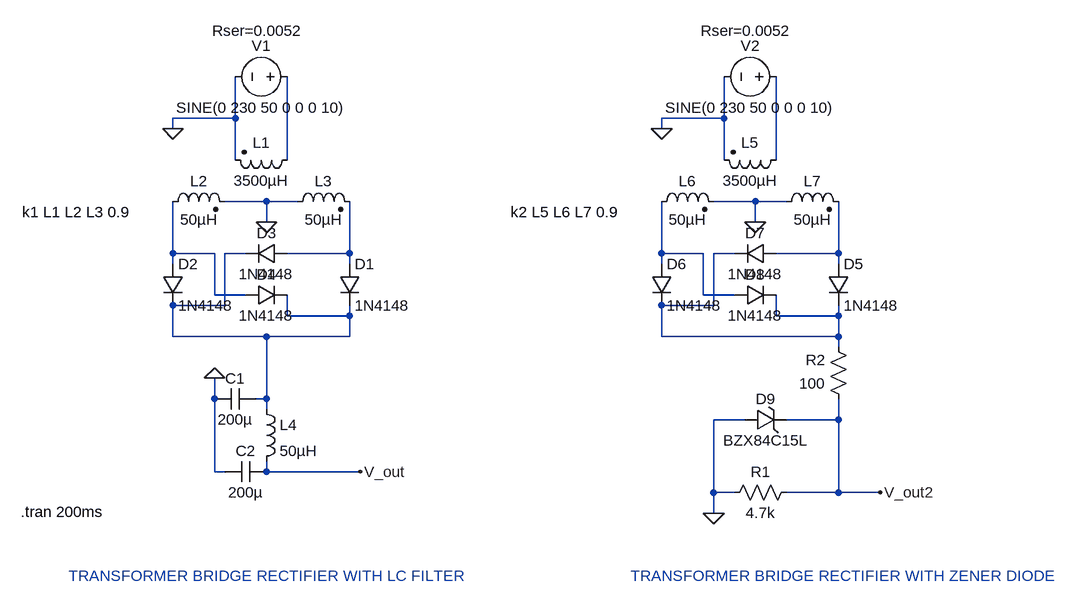
[diagram p0: schematic bride_rectifier_zenerdiode_LCfilter_2019A3PS0443H.asc]
bride_rectifier_zenerdiode_LCfilter_2019A3PS0443H.asc, the LTspice schematic file:
Version 4
SHEET 1 1148 704
WIRE -112 -16 -112 -80
WIRE -112 -16 -208 -16
WIRE 640 -16 640 -80
WIRE 640 -16 544 -16
WIRE -208 0 -208 -16
WIRE 544 0 544 -16
WIRE -112 48 -112 -16
WIRE -32 48 -32 -80
WIRE 640 48 640 -16
WIRE 720 48 720 -80
WIRE -64 112 -128 112
WIRE -16 112 -64 112
WIRE 688 112 624 112
WIRE 736 112 688 112
WIRE -64 144 -64 112
WIRE 688 144 688 112
WIRE -208 192 -208 112
WIRE -144 192 -208 192
WIRE -96 192 -128 192
WIRE 64 192 64 112
WIRE 64 192 -32 192
WIRE 544 192 544 112
WIRE 608 192 544 192
WIRE 656 192 624 192
WIRE 816 192 816 112
WIRE 816 192 720 192
WIRE -208 208 -208 192
WIRE 64 208 64 192
WIRE 544 208 544 192
WIRE 816 208 816 192
WIRE -144 256 -144 192
WIRE -96 256 -144 256
WIRE 608 256 608 192
WIRE 656 256 608 256
WIRE -128 272 -128 192
WIRE -128 272 -208 272
WIRE 624 272 624 192
WIRE 624 272 544 272
WIRE -32 288 -32 256
WIRE 64 288 64 272
WIRE 64 288 -32 288
WIRE 720 288 720 256
WIRE 816 288 816 272
WIRE 816 288 720 288
WIRE -208 320 -208 272
WIRE -64 320 -208 320
WIRE 64 320 64 288
WIRE 64 320 -64 320
WIRE 544 320 544 272
WIRE 816 320 816 288
WIRE 816 320 544 320
WIRE 816 336 816 320
WIRE -144 416 -144 384
WIRE -64 416 -64 320
WIRE -64 416 -80 416
WIRE -64 432 -64 416
WIRE 672 448 624 448
WIRE 816 448 816 416
WIRE 816 448 736 448
WIRE -144 528 -144 416
WIRE -128 528 -144 528
WIRE -64 528 -64 512
WIRE 80 528 -64 528
WIRE 624 560 624 448
WIRE 656 560 624 560
WIRE 816 560 816 448
WIRE 816 560 736 560
WIRE 880 560 816 560
WIRE 624 592 624 560
FLAG -208 0 0
FLAG -144 384 0
FLAG 80 528 V_out
FLAG -64 144 0
FLAG 544 0 0
FLAG 688 144 0
FLAG 624 592 0
FLAG 880 560 V_out2
SYMBOL ind2 -16 32 R90
WINDOW 0 5 56 VBottom 2
WINDOW 3 32 56 VTop 2
SYMATTR InstName L1
SYMATTR Value 3500µH
SYMATTR Type ind
SYMBOL ind2 -224 128 R270
WINDOW 0 32 56 VTop 2
WINDOW 3 4 56 VBottom 2
SYMATTR InstName L2
SYMATTR Value 50µH
SYMATTR Type ind
SYMBOL ind2 -32 128 R270
WINDOW 0 32 56 VTop 2
WINDOW 3 4 56 VBottom 2
SYMATTR InstName L3
SYMATTR Value 50µH
SYMATTR Type ind
SYMBOL diode 48 208 R0
SYMATTR InstName D1
SYMATTR Value 1N4148
SYMBOL diode -224 208 R0
SYMATTR InstName D2
SYMATTR Value 1N4148
SYMBOL cap -80 400 R90
WINDOW 0 0 32 VBottom 2
WINDOW 3 32 32 VTop 2
SYMATTR InstName C1
SYMATTR Value 200µ
SYMBOL voltage -16 -80 R90
WINDOW 0 -32 56 VBottom 2
WINDOW 3 32 56 VTop 2
WINDOW 123 0 0 Left 0
WINDOW 39 -55 62 VBottom 2
SYMATTR InstName V1
SYMATTR Value SINE(0 230 50 0 0 0 10)
SYMATTR SpiceLine Rser=0.0052
SYMBOL ind -80 416 R0
SYMATTR InstName L4
SYMATTR Value 50µH
SYMBOL cap -64 512 R90
WINDOW 0 0 32 VBottom 2
WINDOW 3 32 32 VTop 2
SYMATTR InstName C2
SYMATTR Value 200µ
SYMBOL diode -32 176 R90
WINDOW 0 0 32 VBottom 2
WINDOW 3 32 32 VTop 2
SYMATTR InstName D3
SYMATTR Value 1N4148
SYMBOL diode -96 272 R270
WINDOW 0 32 32 VTop 2
WINDOW 3 0 32 VBottom 2
SYMATTR InstName D4
SYMATTR Value 1N4148
SYMBOL ind2 736 32 R90
WINDOW 0 5 56 VBottom 2
WINDOW 3 32 56 VTop 2
SYMATTR InstName L5
SYMATTR Value 3500µH
SYMATTR Type ind
SYMBOL ind2 528 128 R270
WINDOW 0 32 56 VTop 2
WINDOW 3 4 56 VBottom 2
SYMATTR InstName L6
SYMATTR Value 50µH
SYMATTR Type ind
SYMBOL ind2 720 128 R270
WINDOW 0 32 56 VTop 2
WINDOW 3 4 56 VBottom 2
SYMATTR InstName L7
SYMATTR Value 50µH
SYMATTR Type ind
SYMBOL diode 800 208 R0
SYMATTR InstName D5
SYMATTR Value 1N4148
SYMBOL diode 528 208 R0
SYMATTR InstName D6
SYMATTR Value 1N4148
SYMBOL voltage 736 -80 R90
WINDOW 0 -32 56 VBottom 2
WINDOW 3 32 56 VTop 2
WINDOW 123 0 0 Left 0
WINDOW 39 -55 62 VBottom 2
SYMATTR InstName V2
SYMATTR Value SINE(0 230 50 0 0 0 10)
SYMATTR SpiceLine Rser=0.0052
SYMBOL diode 720 176 R90
WINDOW 0 0 32 VBottom 2
WINDOW 3 32 32 VTop 2
SYMATTR InstName D7
SYMATTR Value 1N4148
SYMBOL diode 656 272 R270
WINDOW 0 32 32 VTop 2
WINDOW 3 0 32 VBottom 2
SYMATTR InstName D8
SYMATTR Value 1N4148
SYMBOL zener 672 464 R270
WINDOW 0 32 32 VTop 2
WINDOW 3 0 32 VBottom 2
SYMATTR InstName D9
SYMATTR Value BZX84C15L
SYMATTR Description Diode
SYMATTR Type diode
SYMBOL res 752 544 R90
WINDOW 0 0 56 VBottom 2
WINDOW 3 32 56 VTop 2
SYMATTR InstName R1
SYMATTR Value 4.7k
SYMBOL res 832 432 R180
WINDOW 0 36 76 Left 2
WINDOW 3 36 40 Left 2
SYMATTR InstName R2
SYMATTR Value 100
TEXT -440 128 Left 2 !k1 L1 L2 L3 0.9
TEXT -442 590 Left 2 !.tran 200ms
TEXT 312 128 Left 2 !k2 L5 L6 L7 0.9
TEXT -368 688 Left 2 ;TRANSFORMER BRIDGE RECTIFIER WITH LC FILTER
TEXT 496 688 Left 2 ;TRANSFORMER BRIDGE RECTIFIER WITH ZENER DIODE

The netlist it stands for:
* bride_rectifier_zenerdiode_LCfilter_2019A3PS0443H.asc
L1 N001 0 3500µH
L2 N003 0 50µH
L3 0 N005 50µH
D1 N005 N004 1N4148
D2 N003 N004 1N4148
C1 N004 0 200µ
V1 N001 0 SINE(0 230 50 0 0 0 10) Rser=0.0052
L4 N004 V_out 50µH
C2 V_out 0 200µ
D3 N005 N004 1N4148
D4 N003 N004 1N4148
L5 N002 0 3500µH
L6 N006 0 50µH
L7 0 N008 50µH
D5 N008 N007 1N4148
D6 N006 N007 1N4148
V2 N002 0 SINE(0 230 50 0 0 0 10) Rser=0.0052
D7 N008 N007 1N4148
D8 N006 N007 1N4148
D9 0 V_out2 BZX84C15L
R1 V_out2 0 4.7k
R2 V_out2 N007 100
.model D D
.lib standard.dio
k1 L1 L2 L3 0.9
.tran 200ms
k2 L5 L6 L7 0.9
* TRANSFORMER BRIDGE RECTIFIER WITH LC FILTER
* TRANSFORMER BRIDGE RECTIFIER WITH ZENER DIODE
.backanno
.end